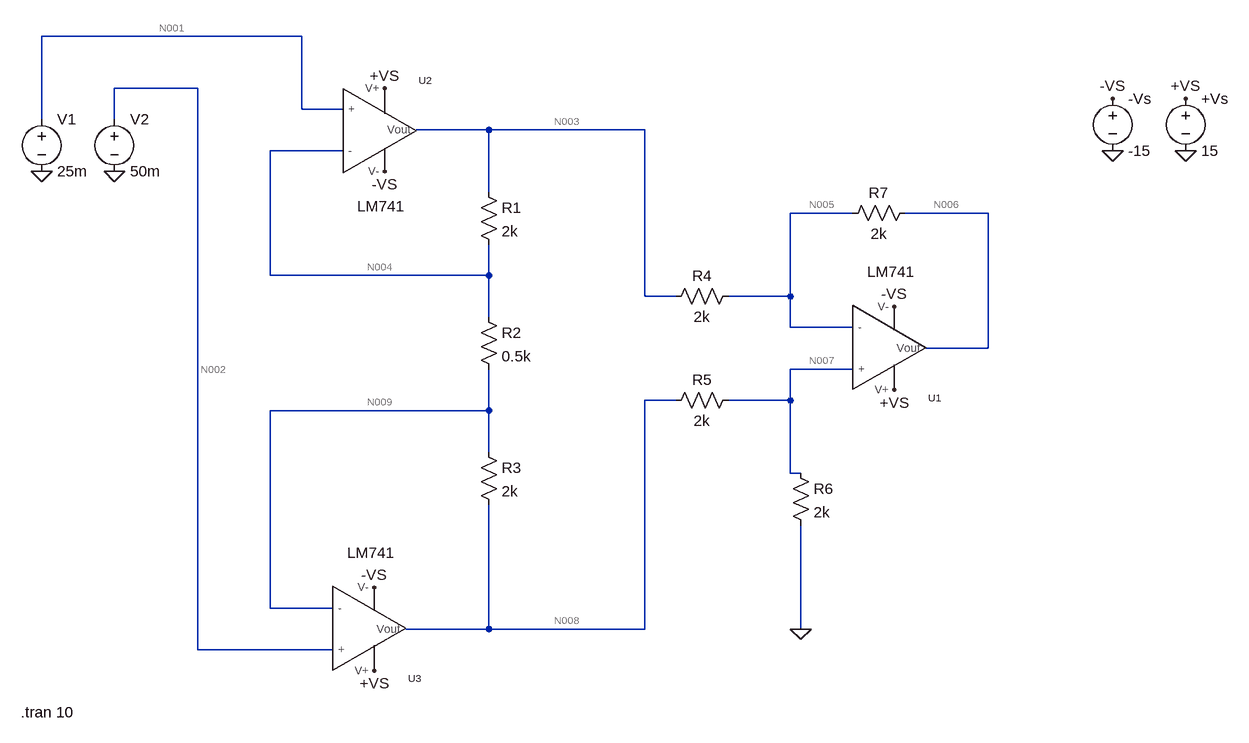
[diagram p0: schematic instrumental amp.asc]
instrumental amp.asc, the LTspice schematic file:
Version 4.1
SHEET 1 984 688
WIRE -448 -368 -848 -368
WIRE -608 -288 -736 -288
WIRE -448 -256 -448 -368
WIRE -384 -256 -448 -256
WIRE -848 -240 -848 -368
WIRE -736 -240 -736 -288
WIRE -160 -224 -272 -224
WIRE 80 -224 -160 -224
WIRE -384 -192 -496 -192
WIRE -160 -128 -160 -224
WIRE 400 -96 304 -96
WIRE 608 -96 480 -96
WIRE -496 0 -496 -192
WIRE -160 0 -160 -48
WIRE -160 0 -496 0
WIRE 80 32 80 -224
WIRE 128 32 80 32
WIRE 304 32 304 -96
WIRE 304 32 208 32
WIRE -160 64 -160 0
WIRE 304 80 304 32
WIRE 400 80 304 80
WIRE 608 112 608 -96
WIRE 608 112 512 112
WIRE 400 144 304 144
WIRE 128 192 80 192
WIRE 304 192 304 144
WIRE 304 192 208 192
WIRE -160 208 -160 144
WIRE -160 208 -496 208
WIRE -160 272 -160 208
WIRE 304 304 304 192
WIRE 320 304 304 304
WIRE -496 512 -496 208
WIRE -400 512 -496 512
WIRE -160 544 -160 352
WIRE -160 544 -288 544
WIRE 80 544 80 192
WIRE 80 544 -160 544
WIRE 320 544 320 384
WIRE -608 576 -608 -288
WIRE -400 576 -608 576
FLAG 320 544 0
FLAG 800 -192 0
FLAG 912 -192 0
FLAG 800 -272 -VS
FLAG 464 48 -VS
FLAG -320 -160 -VS
FLAG -336 480 -VS
FLAG 912 -272 +VS
FLAG 464 176 +VS
FLAG -336 608 +VS
FLAG -320 -288 +VS
FLAG -736 -160 0
FLAG -848 -160 0
SYMBOL LM\ 741\\LM741 448 96 M180
SYMATTR InstName U1
SYMBOL LM\ 741\\LM741 -336 -208 R0
SYMATTR InstName U2
SYMBOL LM\ 741\\LM741 -352 528 M180
SYMATTR InstName U3
SYMBOL res -176 -144 R0
SYMATTR InstName R1
SYMATTR Value 2k
SYMBOL res -176 48 R0
SYMATTR InstName R2
SYMATTR Value 0.5k
SYMBOL res -176 256 R0
SYMATTR InstName R3
SYMATTR Value 2k
SYMBOL res 224 16 R90
WINDOW 0 0 56 VBottom 2
WINDOW 3 32 56 VTop 2
SYMATTR InstName R4
SYMATTR Value 2k
SYMBOL res 224 176 R90
WINDOW 0 0 56 VBottom 2
WINDOW 3 32 56 VTop 2
SYMATTR InstName R5
SYMATTR Value 2k
SYMBOL res 304 288 R0
SYMATTR InstName R6
SYMATTR Value 2k
SYMBOL res 496 -112 R90
WINDOW 0 0 56 VBottom 2
WINDOW 3 32 56 VTop 2
SYMATTR InstName R7
SYMATTR Value 2k
SYMBOL voltage 800 -288 R0
WINDOW 123 0 0 Left 0
WINDOW 39 0 0 Left 0
SYMATTR InstName -Vs
SYMATTR Value -15
SYMBOL voltage 912 -288 R0
WINDOW 123 0 0 Left 0
WINDOW 39 0 0 Left 0
SYMATTR InstName +Vs
SYMATTR Value 15
SYMBOL voltage -848 -256 R0
WINDOW 123 0 0 Left 0
WINDOW 39 0 0 Left 0
SYMATTR InstName V1
SYMATTR Value 25m
SYMBOL voltage -736 -256 R0
WINDOW 123 0 0 Left 0
WINDOW 39 0 0 Left 0
SYMATTR InstName V2
SYMATTR Value 50m
TEXT -880 672 Left 2 !.tran 10

The netlist it stands for:
* instrumental amp.asc
X§U1 N007 N005 +VS -VS N006 LM741  ; pins + - V+ V- Vout
X§U2 N001 N004 +VS -VS N003 LM741  ; pins + - V+ V- Vout
X§U3 N002 N009 +VS -VS N008 LM741  ; pins + - V+ V- Vout
R1 N003 N004 2k
R2 N004 N009 0.5k
R3 N009 N008 2k
R4 N005 N003 2k
R5 N007 N008 2k
R6 N007 0 2k
R7 N006 N005 2k
V§-Vs -VS 0 -15
V§+Vs +VS 0 15
V1 N001 0 25m
V2 N002 0 50m
.tran 10
.lib C:\Users\Subodha\Desktop\Desk\2nd Semester\Electronics\LT Spices\Unity gain amplifier\LM 741\lm741.lib
.backanno
.end

* Results of the author's LTspice run, read from the files saved beside the schematic
* Operating Point, zero values left out:
*   V(n005) = 76.54 mV
*   V(-vs) = -15 V
*   V(n006) = 227.1 mV
*   V(n004) = 26 mV
*   V(n009) = 51 mV
*   V(n007) = 75.54 mV
*   V(+vs) = 15 V
*   V(n001) = 25 mV
*   V(n003) = -73.79 mV
*   V(n002) = 50 mV
*   V(n008) = 151.2 mV
*   I(R3) = -50.1 µA
*   I(R5) = -37.83 µA
*   I(R6) = 37.77 µA
*   I(R1) = -49.9 µA
*   I(-Vs) = 5.125 mA
*   I(V2) = -57.86 nA
*   I(R2) = -50 µA
*   I(R4) = 75.17 µA
*   I(R7) = 75.27 µA
*   I(V1) = -57.85 nA
*   I(+Vs) = -5.163 mA
*   Ix(u2:1) = 57.85 nA
*   Ix(u2:2) = 101.9 nA
*   Ix(u2:99) = 1.66 mA
*   Ix(u2:50) = -1.785 mA
*   Ix(u2:28) = 125.1 µA
*   Ix(u1:1) = 57.86 nA
*   Ix(u1:2) = 101.9 nA
*   Ix(u1:99) = 1.747 mA
*   Ix(u1:50) = -1.672 mA
*   Ix(u1:28) = -75.27 µA
*   Ix(u3:1) = 57.86 nA
*   Ix(u3:2) = 101.9 nA
*   Ix(u3:99) = 1.756 mA
*   Ix(u3:50) = -1.668 mA
*   Ix(u3:28) = -87.93 µA